# Altium project filtroFinal.PrjPcb
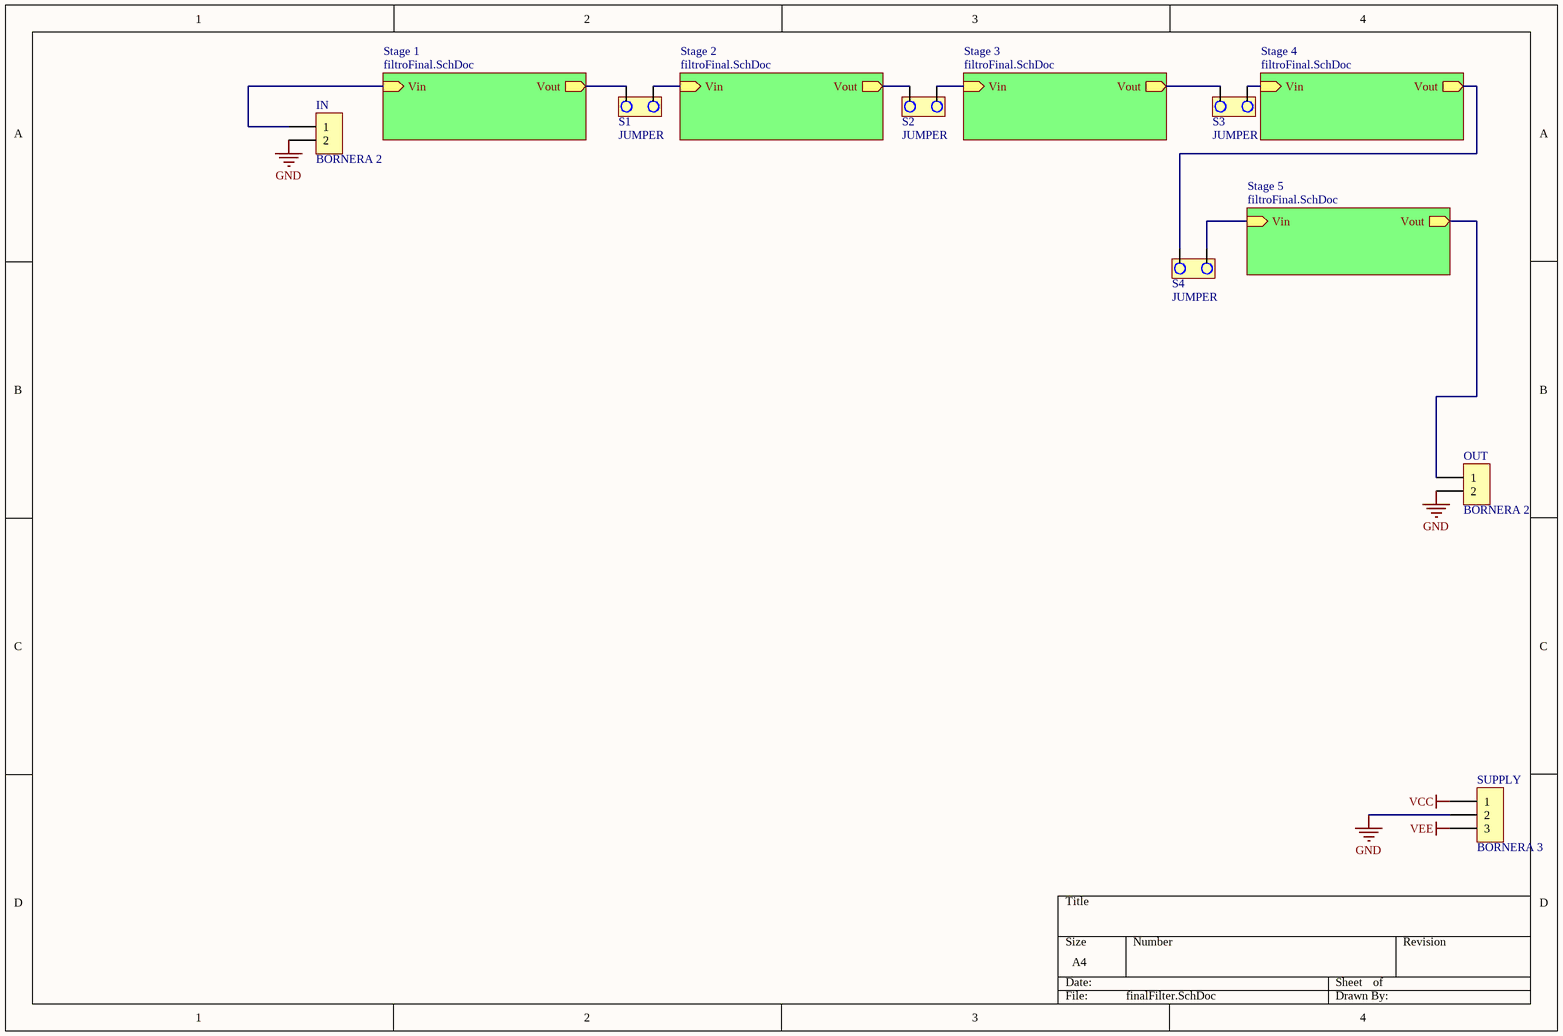
[diagram p0: finalFilter.SchDoc]
2 sheets, 122 parts. Net scope: hierarchical (ports join the sheet entries above them; power ports are global).
Board files: sallenKeyHP.PcbDoc, sallenKey_2.PcbDoc
Sheets:
  finalFilter.SchDoc
    Stage 1 = filtroFinal.SchDoc
    Stage 2 = filtroFinal.SchDoc
    Stage 3 = filtroFinal.SchDoc
    Stage 4 = filtroFinal.SchDoc
    Stage 5 = filtroFinal.SchDoc

## Sheet finalFilter.SchDoc
size A4

### Parts
IN  BORNERA 2  [BORNERA2]
OUT  BORNERA 2  [BORNERA2]
S1  JUMPER  [JUMPER2]
S2  JUMPER  [JUMPER2]
S3  JUMPER  [JUMPER2]
S4  JUMPER  [JUMPER2]
SUPPLY  BORNERA 3  [BORNERA3]

### Sub-sheets
Stage 1 = filtroFinal.SchDoc: Vin (in), Vout (out)
Stage 2 = filtroFinal.SchDoc: Vin (in), Vout (out)
Stage 3 = filtroFinal.SchDoc: Vin (in), Vout (out)
Stage 4 = filtroFinal.SchDoc: Vin (in), Vout (out)
Stage 5 = filtroFinal.SchDoc: Vin (in), Vout (out)

### Nets
GND: IN.2 OUT.2 SUPPLY.2
VCC: SUPPLY.1
VEE: SUPPLY.3
NetC1_Stage_1_1: IN.1 ; sheet Stage 1/Vin
NetC1_Stage_2_1: S1.2 ; sheet Stage 2/Vin
NetC1_Stage_3_1: S2.2 ; sheet Stage 3/Vin
NetC1_Stage_4_1: S3.2 ; sheet Stage 4/Vin
NetC1_Stage_5_1: S4.2 ; sheet Stage 5/Vin
NetOUT_1: OUT.1 ; sheet Stage 5/Vout
NetS1_1: S1.1 ; sheet Stage 1/Vout
NetS2_1: S2.1 ; sheet Stage 2/Vout
NetS3_1: S3.1 ; sheet Stage 3/Vout
NetS4_1: S4.1 ; sheet Stage 4/Vout

## Sheet filtroFinal.SchDoc
size A4
Used 5 times, as channels Stage 1, Stage 2, Stage 3, Stage 4, Stage 5. Parts and nets are listed once, with the designators drawn on the sheet.
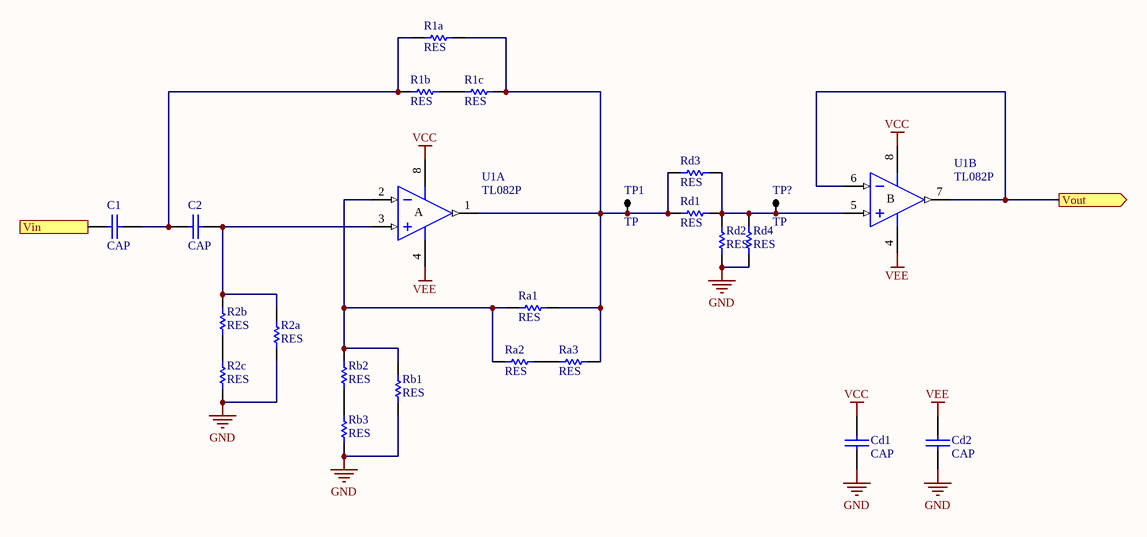
[diagram p1: filtroFinal.SchDoc]

### Parts
C1  CAP  [CAP200]
C2  CAP  [CAP200]
Cd1  CAP  [CAP200]
Cd2  CAP  [CAP200]
R1a  RES  [0805]
R1b  RES  [0805]
R1c  RES  [0805]
R2a  RES  [0805]
R2b  RES  [0805]
R2c  RES  [0805]
Ra1  RES  [0805]
Ra2  RES  [0805]
Ra3  RES  [0805]
Rb1  RES  [0805]
Rb2  RES  [0805]
Rb3  RES  [0805]
Rd1  RES  [0805]
Rd2  RES  [0805]
Rd3  RES  [0805]
Rd4  RES  [0805]
TP1  TP  [TPTH]
TP?  TP  [TPTH]
U1  TL082P  [P008]  (parts A,B of 2)

### Ports
Vin (in), Vout (out)

### Nets
GND: Cd1.2 Cd2.2 R2a.1 R2c.1 Rb1.1 Rb3.1 Rd2.1 Rd4.1
VCC: Cd1.1 U1.8(V+)
VEE: Cd2.1 U1.4(V-)
Vin: C1.1 ; port Vin
Vout: U1.6(IN-) U1.7(OUT) ; port Vout
NetC1_2: C1.2 C2.1 R1a.2 R1b.2
NetC2_2: C2.2 R2a.2 R2b.2 U1.3(IN+)
NetR1a_1: R1a.1 R1c.1 Ra1.1 Ra3.1 Rd1.1 Rd3.1 TP1.1 U1.1(OUT)
NetR1b_1: R1b.1 R1c.2
NetR2b_1: R2b.1 R2c.2
NetRa1_2: Ra1.2 Ra2.2 Rb1.2 Rb2.2 U1.2(IN-)
NetRa2_1: Ra2.1 Ra3.2
NetRb2_1: Rb2.1 Rb3.2
NetRd1_2: Rd1.2 Rd2.2 Rd3.2 Rd4.2 TP?.1 U1.5(IN+)

### Channels
Stage 1: designators end in _Stage_1; ports Vin=NetC1_Stage_1_1 Vout=NetS1_1
Stage 2: designators end in _Stage_2; ports Vin=NetC1_Stage_2_1 Vout=NetS2_1
Stage 3: designators end in _Stage_3; ports Vin=NetC1_Stage_3_1 Vout=NetS3_1
Stage 4: designators end in _Stage_4; ports Vin=NetC1_Stage_4_1 Vout=NetS4_1
Stage 5: designators end in _Stage_5; ports Vin=NetC1_Stage_5_1 Vout=NetOUT_1

### Notes on the sheet
- (in symbol TL082P, part A) A
- (in symbol TL082P, part B) B

### Library data of the parts
U1 = TL082P: JFET-Input Operational Amplifier; Published: 16-Jan-2001; LatestRevisionDate: 04-Mar-2005; LatestRevisionNote: Stylized 3D Model Added.; DatasheetVersion: Feb-1999; PackageVersion: Jun-1999; PackageReference: P008; Publisher: Altium Limited; PackageDescription: DIP; 8 Leads; Row Spacing 7.62 mm; Pitch 2.54 mm; Code_JEDEC: MO-001-AN; ComponentLink1Description: Manufacturer Link; ComponentLink1URL: http://www.ti.com/; ComponentLink2Description: Datasheet; ComponentLink2URL: http://www-s.ti.com/sc/ds/tl082.pdf

## Nets that join several sheets
GND: finalFilter (IN.2 OUT.2 SUPPLY.2), Stage 1 (8 pins), Stage 2 (8 pins), Stage 3 (8 pins), Stage 4 (8 pins), Stage 5 (8 pins)
VCC: finalFilter (SUPPLY.1), Stage 1 (Cd1_Stage_1.1 U1_Stage_1.8), Stage 2 (Cd1_Stage_2.1 U1_Stage_2.8), Stage 3 (Cd1_Stage_3.1 U1_Stage_3.8), Stage 4 (Cd1_Stage_4.1 U1_Stage_4.8), Stage 5 (Cd1_Stage_5.1 U1_Stage_5.8)
VEE: finalFilter (SUPPLY.3), Stage 1 (Cd2_Stage_1.1 U1_Stage_1.4), Stage 2 (Cd2_Stage_2.1 U1_Stage_2.4), Stage 3 (Cd2_Stage_3.1 U1_Stage_3.4), Stage 4 (Cd2_Stage_4.1 U1_Stage_4.4), Stage 5 (Cd2_Stage_5.1 U1_Stage_5.4)
NetC1_Stage_1_1: finalFilter (IN.1), Stage 1 (C1_Stage_1.1)
NetC1_Stage_2_1: finalFilter (S1.2), Stage 2 (C1_Stage_2.1)
NetC1_Stage_3_1: finalFilter (S2.2), Stage 3 (C1_Stage_3.1)
NetC1_Stage_4_1: finalFilter (S3.2), Stage 4 (C1_Stage_4.1)
NetC1_Stage_5_1: finalFilter (S4.2), Stage 5 (C1_Stage_5.1)
NetOUT_1: finalFilter (OUT.1), Stage 5 (U1_Stage_5.6 U1_Stage_5.7)
NetS1_1: finalFilter (S1.1), Stage 1 (U1_Stage_1.6 U1_Stage_1.7)
NetS2_1: finalFilter (S2.1), Stage 2 (U1_Stage_2.6 U1_Stage_2.7)
NetS3_1: finalFilter (S3.1), Stage 3 (U1_Stage_3.6 U1_Stage_3.7)
NetS4_1: finalFilter (S4.1), Stage 4 (U1_Stage_4.6 U1_Stage_4.7)